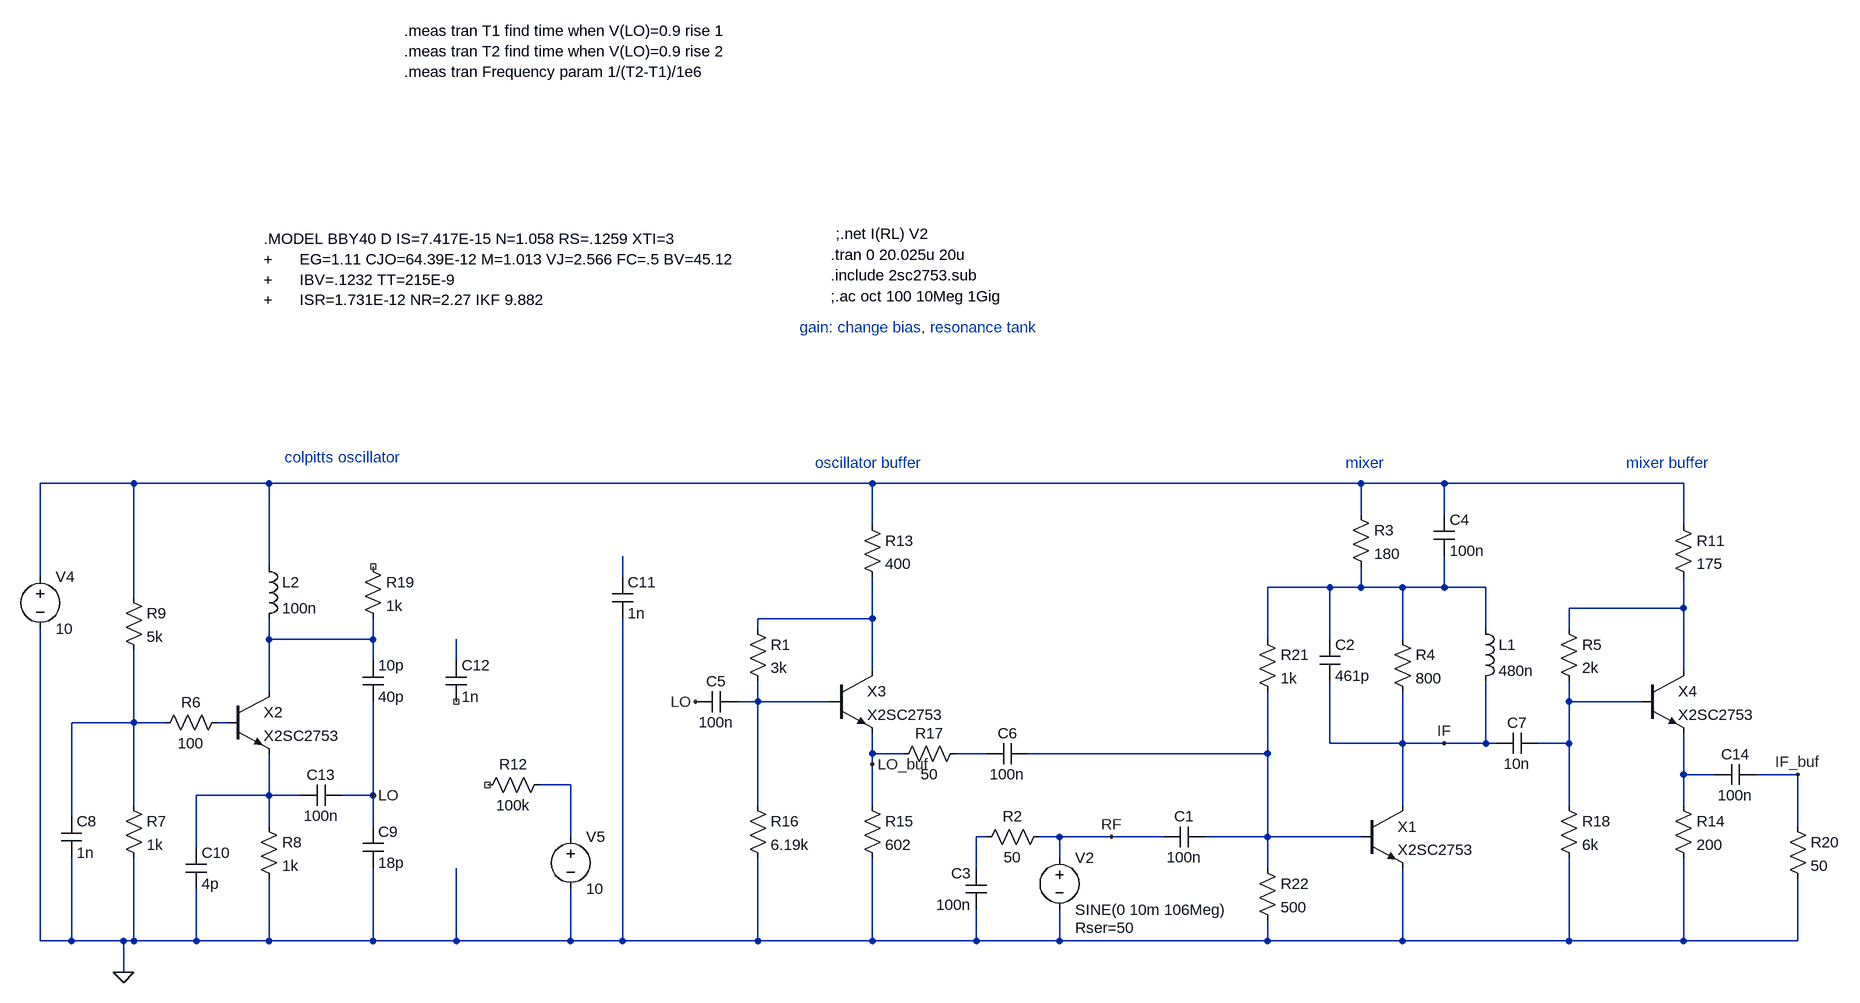
[diagram p0: schematic mixer-oscillator.asc]
mixer-oscillator.asc, the LTspice schematic file:
Version 4
SHEET 1 3924 2228
WIRE -560 -112 -704 -112
WIRE -352 -112 -560 -112
WIRE 576 -112 -352 -112
WIRE 1328 -112 576 -112
WIRE 1456 -112 1328 -112
WIRE 1824 -112 1456 -112
WIRE 1328 -64 1328 -112
WIRE 1456 -64 1456 -112
WIRE 576 -48 576 -112
WIRE 1824 -48 1824 -112
WIRE -352 16 -352 -112
WIRE -704 32 -704 -112
WIRE 192 32 192 0
WIRE 1280 48 1184 48
WIRE 1328 48 1328 16
WIRE 1328 48 1280 48
WIRE 1392 48 1328 48
WIRE 1456 48 1456 0
WIRE 1456 48 1392 48
WIRE 1520 48 1456 48
WIRE -560 64 -560 -112
WIRE 1824 80 1824 32
WIRE 1824 80 1648 80
WIRE 576 96 576 32
WIRE 576 96 400 96
WIRE 400 112 400 96
WIRE 1520 112 1520 48
WIRE 1648 112 1648 80
WIRE -352 128 -352 96
WIRE -192 128 -192 96
WIRE -192 128 -352 128
WIRE 1184 128 1184 48
WIRE 1280 128 1280 48
WIRE 1392 128 1392 48
WIRE -192 160 -192 128
WIRE -64 160 -64 128
WIRE 576 176 576 96
WIRE 1824 176 1824 80
WIRE -352 208 -352 128
WIRE 400 224 400 192
WIRE 400 224 368 224
WIRE 512 224 400 224
WIRE 1648 224 1648 192
WIRE 1760 224 1648 224
WIRE -560 256 -560 144
WIRE -560 256 -656 256
WIRE -512 256 -560 256
WIRE -416 256 -432 256
WIRE 1280 288 1280 192
WIRE 1392 288 1392 208
WIRE 1392 288 1280 288
WIRE 1456 288 1392 288
WIRE 1520 288 1520 192
WIRE 1520 288 1456 288
WIRE 1536 288 1520 288
WIRE 1648 288 1648 224
WIRE 1648 288 1600 288
WIRE 576 304 576 272
WIRE 624 304 576 304
WIRE 752 304 704 304
WIRE 1184 304 1184 208
WIRE 1184 304 816 304
WIRE 576 320 576 304
WIRE 1824 336 1824 272
WIRE 1872 336 1824 336
WIRE 2000 336 1936 336
WIRE 112 352 64 352
WIRE -352 368 -352 304
WIRE -352 368 -464 368
WIRE -304 368 -352 368
WIRE -192 368 -192 224
WIRE -192 368 -240 368
WIRE -560 384 -560 256
WIRE 400 384 400 224
WIRE 576 384 576 320
WIRE 1392 384 1392 288
WIRE 1648 384 1648 288
WIRE 1824 384 1824 336
WIRE -656 400 -656 256
WIRE -352 416 -352 368
WIRE -192 416 -192 368
WIRE 2000 416 2000 336
WIRE 112 432 112 352
WIRE 752 432 736 432
WIRE 864 432 832 432
WIRE 944 432 864 432
WIRE 1024 432 944 432
WIRE 1184 432 1184 304
WIRE 1184 432 1088 432
WIRE 1328 432 1184 432
WIRE -464 448 -464 368
WIRE 864 464 864 432
WIRE 736 480 736 432
WIRE 1184 480 1184 432
WIRE -704 592 -704 112
WIRE -656 592 -656 464
WIRE -656 592 -704 592
WIRE -576 592 -656 592
WIRE -560 592 -560 464
WIRE -560 592 -576 592
WIRE -464 592 -464 512
WIRE -464 592 -560 592
WIRE -352 592 -352 496
WIRE -352 592 -464 592
WIRE -192 592 -192 480
WIRE -192 592 -352 592
WIRE -64 592 -64 480
WIRE -64 592 -192 592
WIRE 112 592 112 512
WIRE 112 592 -64 592
WIRE 192 592 192 96
WIRE 192 592 112 592
WIRE 400 592 400 464
WIRE 400 592 192 592
WIRE 576 592 576 464
WIRE 576 592 400 592
WIRE 736 592 736 544
WIRE 736 592 576 592
WIRE 864 592 864 544
WIRE 864 592 736 592
WIRE 1184 592 1184 560
WIRE 1184 592 864 592
WIRE 1392 592 1392 480
WIRE 1392 592 1184 592
WIRE 1648 592 1648 464
WIRE 1648 592 1392 592
WIRE 1824 592 1824 464
WIRE 1824 592 1648 592
WIRE 2000 592 2000 496
WIRE 2000 592 1824 592
WIRE -576 640 -576 592
FLAG -576 640 0
FLAG -192 368 LO
FLAG 304 224 LO
FLAG 1456 288 IF
FLAG 2000 336 IF_buf
FLAG 944 432 RF
FLAG 576 320 LO_buf
SYMBOL Cap 1264 128 R0
SYMATTR InstName C2
SYMATTR Value 461p
SYMBOL ind 1504 96 R0
SYMATTR InstName L1
SYMATTR Value 480n
SYMBOL Cap 752 544 R180
WINDOW 0 24 56 Left 2
WINDOW 3 24 8 Left 2
SYMATTR InstName C3
SYMATTR Value 100n
SYMBOL cap -672 400 R0
SYMATTR InstName C8
SYMATTR Value 1n
SYMBOL res -576 368 R0
SYMATTR InstName R7
SYMATTR Value 1k
SYMBOL res -368 400 R0
SYMATTR InstName R8
SYMATTR Value 1k
SYMBOL res -576 48 R0
SYMATTR InstName R9
SYMATTR Value 5k
SYMBOL cap -208 416 R0
SYMATTR InstName C9
SYMATTR Value 18p
SYMBOL cap -208 160 R0
SYMATTR InstName 10p
SYMATTR Value 40p
SYMBOL cap 176 32 R0
SYMATTR InstName C11
SYMATTR Value 1n
SYMBOL cap -80 160 R0
SYMATTR InstName C12
SYMATTR Value 1n
SYMBOL ind -368 0 R0
SYMATTR InstName L2
SYMATTR Value 100n
SYMBOL npn -416 208 R0
SYMATTR InstName X2
SYMATTR Value X2SC2753
SYMATTR Prefix X
SYMBOL voltage -704 16 R0
WINDOW 123 0 0 Left 0
WINDOW 39 0 0 Left 0
SYMATTR InstName V4
SYMATTR Value 10
SYMBOL res 80 336 R90
WINDOW 0 0 56 VBottom 2
WINDOW 3 32 56 VTop 2
SYMATTR InstName R12
SYMATTR Value 100k
SYMBOL voltage 112 416 R0
WINDOW 123 0 0 Left 0
WINDOW 39 0 0 Left 0
SYMATTR InstName V5
SYMATTR Value 10
SYMBOL res -416 240 R90
WINDOW 0 0 56 VBottom 2
WINDOW 3 32 56 VTop 2
SYMATTR InstName R6
SYMATTR Value 100
SYMBOL voltage 864 448 R0
WINDOW 123 0 0 Left 0
WINDOW 39 24 124 Left 2
SYMATTR SpiceLine Rser=50
SYMATTR InstName V2
SYMATTR Value SINE(0 10m 106Meg)
SYMBOL cap -240 352 R90
WINDOW 0 0 32 VBottom 2
WINDOW 3 32 32 VTop 2
SYMATTR InstName C13
SYMATTR Value 100n
SYMBOL res 384 96 R0
SYMATTR InstName R1
SYMATTR Value 3k
SYMBOL res 560 -64 R0
SYMATTR InstName R13
SYMATTR Value 400
SYMBOL res 560 368 R0
SYMATTR InstName R15
SYMATTR Value 602
SYMBOL res 384 368 R0
SYMATTR InstName R16
SYMATTR Value 6.19k
SYMBOL cap 368 208 R90
WINDOW 0 0 32 VBottom 2
WINDOW 3 32 32 VTop 2
SYMATTR InstName C5
SYMATTR Value 100n
SYMBOL npn 512 176 R0
SYMATTR InstName X3
SYMATTR Value X2SC2753
SYMATTR Prefix X
SYMBOL res 720 288 R90
WINDOW 0 0 56 VBottom 2
WINDOW 3 32 56 VTop 2
SYMATTR InstName R17
SYMATTR Value 50
SYMBOL cap 816 288 R90
WINDOW 0 0 32 VBottom 2
WINDOW 3 32 32 VTop 2
SYMATTR InstName C6
SYMATTR Value 100n
SYMBOL npn 1328 384 R0
SYMATTR InstName X1
SYMATTR Value X2SC2753
SYMATTR Prefix X
SYMBOL res 848 416 R90
WINDOW 0 0 56 VBottom 2
WINDOW 3 32 56 VTop 2
SYMATTR InstName R2
SYMATTR Value 50
SYMBOL cap 1088 416 R90
WINDOW 0 0 32 VBottom 2
WINDOW 3 32 32 VTop 2
SYMATTR InstName C1
SYMATTR Value 100n
SYMBOL res 1312 -80 R0
SYMATTR InstName R3
SYMATTR Value 180
SYMBOL cap 1440 -64 R0
SYMATTR InstName C4
SYMATTR Value 100n
SYMBOL res 1632 96 R0
SYMATTR InstName R5
SYMATTR Value 2k
SYMBOL res 1808 -64 R0
SYMATTR InstName R11
SYMATTR Value 175
SYMBOL res 1808 368 R0
SYMATTR InstName R14
SYMATTR Value 200
SYMBOL res 1632 368 R0
SYMATTR InstName R18
SYMATTR Value 6k
SYMBOL cap 1600 272 R90
WINDOW 0 0 32 VBottom 2
WINDOW 3 32 32 VTop 2
SYMATTR InstName C7
SYMATTR Value 10n
SYMBOL npn 1760 176 R0
SYMATTR InstName X4
SYMATTR Value X2SC2753
SYMATTR Prefix X
SYMBOL res 1168 112 R0
SYMATTR InstName R21
SYMATTR Value 1k
SYMBOL res 1168 464 R0
SYMATTR InstName R22
SYMATTR Value 500
SYMBOL res 1376 112 R0
SYMATTR InstName R4
SYMATTR Value 800
SYMBOL cap 1936 320 R90
WINDOW 0 0 32 VBottom 2
WINDOW 3 32 32 VTop 2
SYMATTR InstName C14
SYMATTR Value 100n
SYMBOL res 1984 400 R0
SYMATTR InstName R20
SYMATTR Value 50
SYMBOL cap -480 448 R0
SYMATTR InstName C10
SYMATTR Value 4p
SYMBOL res -208 0 R0
SYMATTR InstName R19
SYMATTR Value 1k
TEXT 512 -464 Left 2 !.tran 0 20.025u 20u
TEXT 512 -432 Left 2 !.include 2sc2753.sub
TEXT -360 -488 Left 2 !.MODEL BBY40 D IS=7.417E-15 N=1.058 RS=.1259 XTI=3 \n+      EG=1.11 CJO=64.39E-12 M=1.013 VJ=2.566 FC=.5 BV=45.12 \n+      IBV=.1232 TT=215E-9\n+      ISR=1.731E-12 NR=2.27 IKF 9.882
TEXT 512 -400 Left 2 !;.ac oct 100 10Meg 1Gig
TEXT 520 -496 Left 2 !;.net I(RL) V2
TEXT 464 -352 Left 2 ;gain: change bias, resonance tank
TEXT -328 -152 Left 2 ;colpitts oscillator
TEXT 488 -144 Left 2 ;oscillator buffer
TEXT 1304 -144 Left 2 ;mixer
TEXT 1736 -144 Left 2 ;mixer buffer
TEXT -144 -808 Left 2 !.meas tran T1 find time when V(LO)=0.9 rise 1\n.meas tran T2 find time when V(LO)=0.9 rise 2\n.meas tran Frequency param 1/(T2-T1)/1e6

The netlist it stands for:
* mixer-oscillator.asc
C2 N003 IF 461p
L1 N003 IF 480n
C3 0 N017 100n
C8 N010 0 1n
R7 N010 0 1k
R8 N016 0 1k
R9 N001 N010 5k
C9 LO 0 18p
C§10p N006 LO 40p
C11 N002 0 1n
C12 N007 NC_01 1n
L2 N001 N006 100n
XX2 N006 N011 N016 X2SC2753  ; pins C B E
V4 N001 0 10
R12 N015 NC_02 100k
V5 N015 0 10
R6 N011 N010 100
V2 RF 0 SINE(0 10m 106Meg) Rser=50
C13 LO N016 100n
R1 N005 N008 3k
R13 N001 N005 400
R15 LO_buf 0 602
R16 N008 0 6.19k
C5 N008 LO 100n
XX3 N005 N008 LO_buf X2SC2753  ; pins C B E
R17 N012 LO_buf 50
C6 N013 N012 100n
XX1 IF N013 0 X2SC2753  ; pins C B E
R2 RF N017 50
C1 N013 RF 100n
R3 N001 N003 180
C4 N001 N003 100n
R5 N004 N009 2k
R11 N001 N004 175
R14 N014 0 200
R18 N009 0 6k
C7 N009 IF 10n
XX4 N004 N009 N014 X2SC2753  ; pins C B E
R21 N003 N013 1k
R22 N013 0 500
R4 N003 IF 800
C14 IF_buf N014 100n
R20 IF_buf 0 50
C10 N016 0 4p
R19 NC_03 N006 1k
.tran 0 20.025u 20u
.include 2sc2753.sub
.MODEL BBY40 D IS=7.417E-15 N=1.058 RS=.1259 XTI=3
+      EG=1.11 CJO=64.39E-12 M=1.013 VJ=2.566 FC=.5 BV=45.12
+      IBV=.1232 TT=215E-9
+      ISR=1.731E-12 NR=2.27 IKF 9.882
;.ac oct 100 10Meg 1Gig
;.net I(RL) V2
* gain: change bias, resonance tank
* colpitts oscillator
* oscillator buffer
* mixer
* mixer buffer
.meas tran T1 find time when V(LO)=0.9 rise 1
.meas tran T2 find time when V(LO)=0.9 rise 2
.meas tran Frequency param 1/(T2-T1)/1e6
.backanno
.end